# EAGLE design Pure Noise (EAGLE 9.6.2)
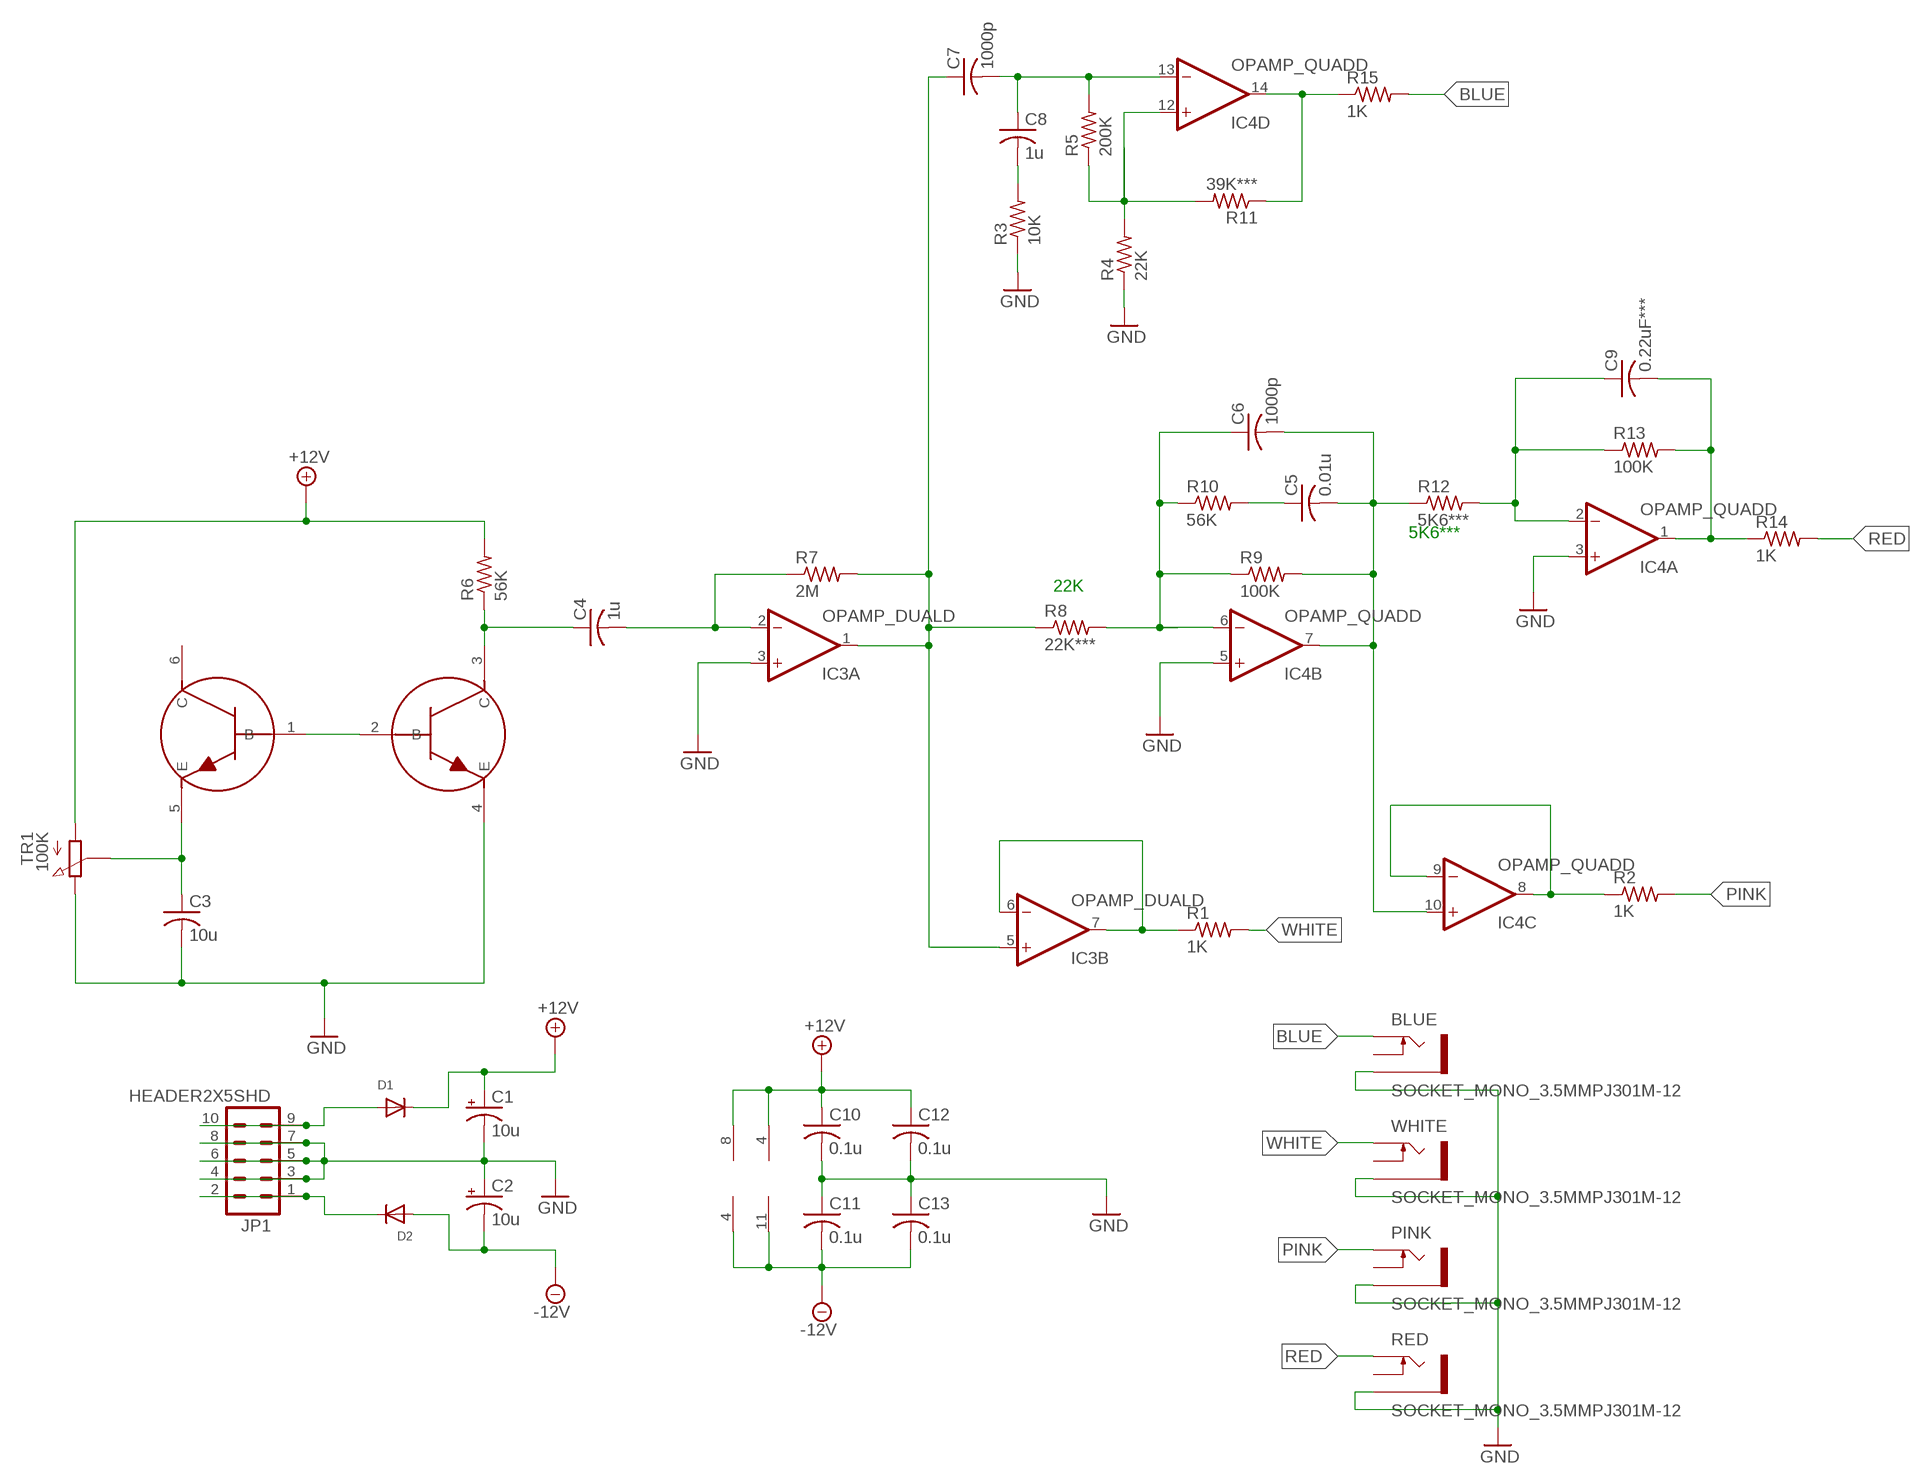
[diagram p0: schematic, sheet 1]

## Parts
BLUE  SOCKET_MONO_3.5MMPJ301M-12  [PJ301M-12]
C1  10u  CAPACITOR_POL-US153CLV-0505  [153CLV-0505]
C2  10u  CAPACITOR_POL-US153CLV-0505  [153CLV-0505]
C3  10u  CAPACITOR-USC0805  [C0805]
C4  1u  CAPACITOR-USC0805  [C0805]
C5  0.01u  CAPACITOR-USC0805  [C0805]
C6  1000p  CAPACITOR-USC0805  [C0805]
C7  1000p  CAPACITOR-USC0805  [C0805]
C8  1u  CAPACITOR-USC0805  [C0805]
C9  0.22uF***  CAPACITOR-USC0805  [C0805]
C10  0.1u  CAPACITOR-USC0805  [C0805]
C11  0.1u  CAPACITOR-USC0805  [C0805]
C12  0.1u  CAPACITOR-USC0805  [C0805]
C13  0.1u  CAPACITOR-USC0805  [C0805]
D1  DIODESMA  [SMADIODE]
D2  DIODESMA  [SMADIODE]
IC3  OPAMP_DUALD  [SO08]
IC4  OPAMP_QUADD  [SO14]
JP1  HEADER2X5SHD  [2X5-SHROUDED]
PINK  SOCKET_MONO_3.5MMPJ301M-12  [PJ301M-12]
R1  1K  RESISTOR_USR0805  [R0805]
R2  1K  RESISTOR_USR0805  [R0805]
R3  10K  RESISTOR_USR0805  [R0805]
R4  22K  RESISTOR_USR0805  [R0805]
R5  200K  RESISTOR_USR0805  [R0805]
R6  56K  RESISTOR_USR0805  [R0805]
R7  2M  RESISTOR_USR0805  [R0805]
R8  22K***  RESISTOR_USR0805  [R0805]
R9  100K  RESISTOR_USR0805  [R0805]
R10  56K  RESISTOR_USR0805  [R0805]
R11  39K***  RESISTOR_USR0805  [R0805]
R12  5K6***  RESISTOR_USR0805  [R0805]
R13  100K  RESISTOR_USR0805  [R0805]
R14  1K  RESISTOR_USR0805  [R0805]
R15  1K  RESISTOR_USR0805  [R0805]
RED  SOCKET_MONO_3.5MMPJ301M-12  [PJ301M-12]
T1  TRANSISTOR_PAIR_NPN  [TRANS_PAIR]
TR1  100K  RESISTOR_VARIABLETRIMMER_TH  [TRIMMER_TH]
WHITE  SOCKET_MONO_3.5MMPJ301M-12  [PJ301M-12]

## Nets
+12V: C1.+ C10.1 C12.1 D1.C IC3.8(P:V+) IC4.4(P:V+) R6.2 TR1.1
-12V: C2.- C11.2 C13.2 D2.A IC3.4(P:V-) IC4.11(P:V-)
BLUE: BLUE.TIP R15.2
GND: BLUE.GND(SLEEVE) C1.- C2.+ C3.2 C10.2 C11.1 C12.2 C13.1 IC3.3(A:+IN) IC4.3(A:+IN) IC4.5(B:+IN) JP1.3 JP1.4 JP1.5 JP1.6 JP1.7 JP1.8 PINK.GND(SLEEVE) R3.1 R4.1 RED.GND(SLEEVE) T1.4(E) TR1.3 WHITE.GND(SLEEVE)
N$1: IC3.6(B:-IN) IC3.7(B:OUT) R1.1
N$2: IC4.8(C:OUT) IC4.9(C:-IN) R2.1
N$3: C8.2 R3.2
N$4: C7.2 C8.1 IC4.13(D:-IN) R5.2
N$5: IC4.12(D:+IN) R4.2 R5.1 R11.2
N$6: C9.1 IC4.2(A:-IN) R12.2 R13.1
N$7: C9.2 IC4.1(A:OUT) R13.2 R14.1
N$9: D1.A JP1.9 JP1.10
N$10: D2.C JP1.1 JP1.2
N$11: IC4.14(D:OUT) R11.1 R15.1
N$12: T1.1(B) T1.2(B)
N$13: C3.1 T1.5(E) TR1.2
N$14: C4.1 R6.1 T1.3(C)
N$15: C4.2 IC3.2(A:-IN) R7.1
N$16: C6.1 IC4.6(B:-IN) R8.2 R9.1 R10.1
N$17: C5.1 R10.2
N$19: C7.1 IC3.1(A:OUT) IC3.5(B:+IN) R7.2 R8.1
N$23: C5.2 C6.2 IC4.7(B:OUT) IC4.10(C:+IN) R9.2 R12.1
PINK: PINK.TIP R2.2
RED: R14.2 RED.TIP
WHITE: R1.2 WHITE.TIP
Unconnected: BLUE.NORM(SWITCH) PINK.NORM(SWITCH) RED.NORM(SWITCH) T1.6(C) WHITE.NORM(SWITCH)

## Notes on the sheet
- 5K6***
- 22K

## Library data of the parts
BLUE PINK RED WHITE = GMSN:SOCKET_MONO_3.5MM: 3.5 mm Jack Socket; SORT: 8
C1 C2 = GMSN:CAPACITOR_POL-US: Electro Capacitor; SORT: 3
C3-C13 = GMSN:CAPACITOR-US: Capacitor; SORT: 3
D1 D2 = GMSN:DIODE: Diode SMADIODE - SMA Surface Mount Package 20V 1A Schottky Diode Digikey: 641-1014-6-ND DO-1N4148 - Through Hole Small Current Diode SOD-123 20V 1 A (.5mV Vf) Schottky Diode - Digikey: MBRX120TPMSCT-ND SOD-323 10V 570mA (.38mV Vf, 3ns) Schottky Diode - Digikey: ZLLS410CT-ND SOD-523 30V 30mA Schottky Diode (RB751S-40TE61) - Digikey: RB751S-40TE61CT-ND SOT23-R/W - SOT23 Package (R = Solder Paste/Reflow Ovens, W = Hand-Soldering) BAT54Film 40V 300mA - Digikey: 497-7162-1-ND; SORT: 3.9
IC3 = GMSN:OPAMP_DUAL: Dual Op Amp; SORT: 4.5
IC4 = GMSN:OPAMP_QUAD: OP AMP; SORT: 4.5
JP1 = GMSN:HEADER2X5: Header 5x2 Standard 10-pin dual row 0.1" header. Commonly used with AVR-ISP. Use with Spark Fun Electronics SKU: PRT-00778; SORT: 7
R1-R15 = GMSN:RESISTOR_US: Resistor; SORT: 2
T1 = GMSN:TRANSISTOR_PAIR_NPN: NPN Transistor Matched Pair; SORT: 4
TR1 = GMSN:RESISTOR_VARIABLE: Pot; SORT: 7

## Board
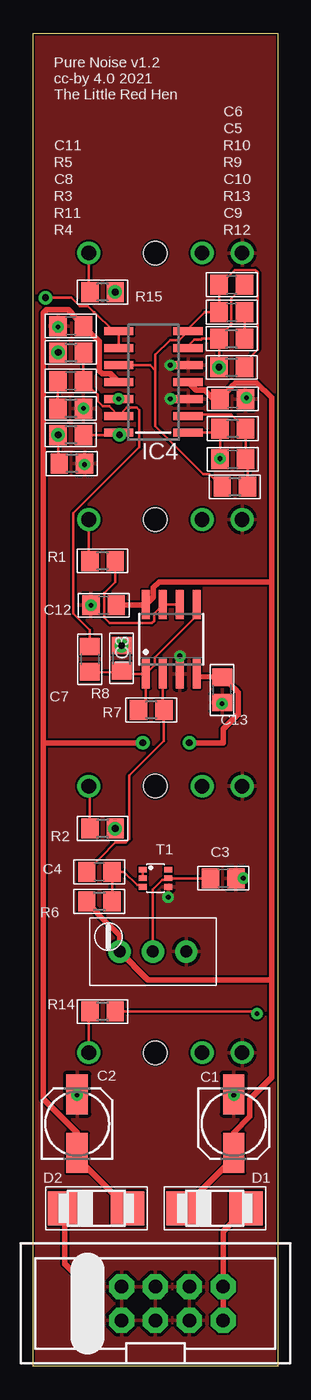
[diagram p1: board, top side]
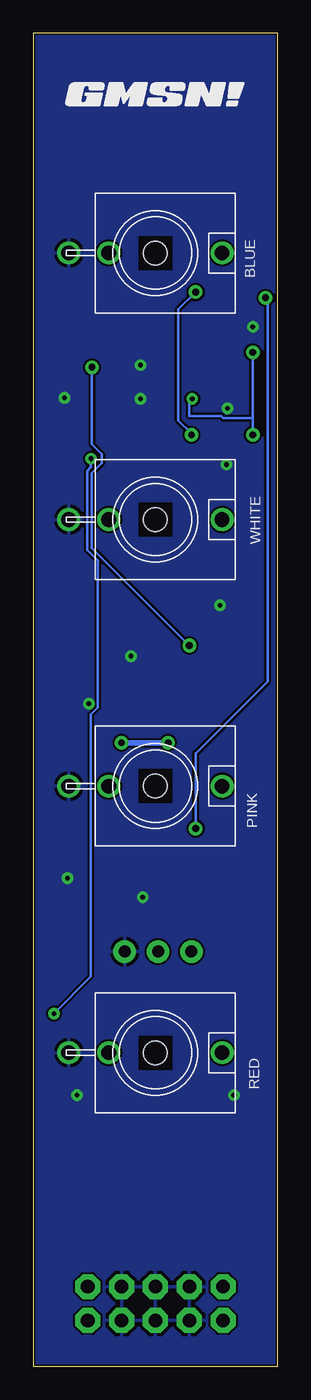
[diagram p2: board, bottom side, seen from below]

Size 18.32 x 100 mm. Coordinates in mm from the lower left corner, seen from the top.
Outline: 18.32,0 0,0 0,100 18.32,100 18.32,0
Copper layers (1*16): Top 0.035mm / dielectric 1.5mm / Bottom 0.035mm
Design rules "PCBWay": minimum track width 6mil, minimum drill 12mil, track to track 6mil, track to pad 6mil, pad to pad 6mil, via to via 6mil, smd to smd 6mil, copper to edge 6mil, drill to drill 6mil, minimum pad ring 12mil, minimum via ring 10mil, stop-mask expansion 4mil, vias tented up to drill 25mil, thermal gap 10mil

### Footprints (pad centres in the part's own frame; a part is rotated, then mirrored left to right if it is on the bottom)
PJ301M-12 = drill 1.1: GND 0,-6.5; NORM 0,-3.5; TIP 0,5 | hole 1.778: 0,0
153CLV-0505 = smd 3 x 1.6: + 2.2,0; - -2.2,0
C0805 = smd 1.3 x 1.5: 1 -0.95,0; 2 0.95,0
SMADIODE = smd 2.54 x 2.54: A 2.349,0; C -2.349,0
SO08 = smd 0.6 x 2.2: 1 -1.905,-2.6; 2 -0.635,-2.6; 3 0.635,-2.6; 4 1.905,-2.6; 5 1.905,2.6; 6 0.635,2.6; 7 -0.635,2.6; 8 -1.905,2.6
SO14 = smd 0.6 x 2.2: 1 -3.81,-2.6; 2 -2.54,-2.6; 3 -1.27,-2.6; 4 0,-2.6; 5 1.27,-2.6; 6 2.54,-2.6; 7 3.81,-2.6; 8 3.81,2.6; 9 2.54,2.6; 10 1.27,2.6; 11 0,2.6; 12 -1.27,2.6; 13 -2.54,2.6; 14 -3.81,2.6
2X5-SHROUDED = drill 1.016 pad 1.88 octagon: 1 -1.27,5.08; 2 1.27,5.08; 3 -1.27,2.54; 4 1.27,2.54; 5 -1.27,0; 6 1.27,0; 7 -1.27,-2.54; 8 1.27,-2.54; 9 -1.27,-5.08; 10 1.27,-5.08
R0805 = smd 1.3 x 1.5: 1 -0.95,0; 2 0.95,0
TRANS_PAIR = smd 0.42 x 0.6: 1 -0.65,-0.95; 2 0,-0.95; 3 0.65,-0.95; 4 0.65,0.95; 5 0,0.95; 6 -0.65,0.95
TRIMMER_TH = drill 0.9 pad 1.676: 1 -0.802,1.143; 2 -3.302,1.143; 3 -5.802,1.143

### Placement (x,y rotation side)
BLUE  9.16,83.52 270 bottom
C1  15.03,18.19 270 top
C2  3.29,18.19 90 top
C3  14.24,36.61 0 top
C4  4.95,37.09 180 top
C5  14.88,79.08 180 top
C6  14.88,81.14 180 top
C7  4.24,53.04 90 top
C8  2.81,73.92 180 top
C9  14.95,68.04 180 top
C10  14.95,72.57 0 top
C11  2.81,78.04 0 top
C12  5.27,57.09 180 top
C13  14.16,50.74 90 top
D1  13.61,11.84 0 top
D2  4.71,11.84 0 top
IC3  10.35,54.55 0 top
IC4  9,73.84 90 top
JP1  9.16,4.7 90 top
PINK  9.16,43.52 270 bottom
R1  5.19,60.42 180 top
R2  5.19,40.34 180 top
R3  2.81,71.85 180 top
R4  2.89,67.72 180 top
R5  2.81,76.06 0 top
R6  4.95,34.86 180 top
R7  8.84,49.23 180 top
R8  6.62,53.12 90 top
R9  14.88,74.95 0 top
R10  14.88,77.09 0 top
R11  2.81,69.87 180 top
R12  15.11,65.98 0 top
R13  14.95,70.34 180 top
R14  5.19,26.61 180 top
R15  5.19,80.58 180 top
RED  9.16,23.52 270 bottom
T1  9.16,36.61 270 top
TR1  5.67,32.24 180 top
U$3  [GMSN!_LOGO]  8.92,95.35 0 bottom
WHITE  9.16,63.52 270 bottom

### Tracks (layer width: path | path; a pad name or v marks a point on that pad's centre or on a via)
+12V
  Top 0.406: D1.C 15.03,15.62 C1.+ 15.03,17.52 16.24,18.73 16.24,20.04 17.86,21.66 17.86,28.91 | 17.86,58.83 17.86,28.91 | C12.1 8.39,57.09 IC3.8 9.01,57.71 9.01,58.42 9.43,58.83 17.86,58.83 | 17.86,28.91 17.78,28.99 8.58,28.99 TR1.1 6.47,32.32 4.85,33.94 4.85,34.02 R6.2 | 17.86,58.83 17.86,72.68 16.77,73.77 15.14,73.77 14.9,73.53 14.9,73.51 C10.1 13.5,72.57 12.85,73.22 12.22,73.22 IC4.4
-12V  (via drill 0.51)
  Top 0.406: D2.A 3.29,15.62 C2.- 3.29,17.52 0.75,20.05 0.75,46.77 | 0.75,46.77 0.75,79.01 0.99,79.25 2.63,79.25 2.87,79.01 2.87,78.99 C11.2 4.95,76.91 4.95,74.66 5.15,74.45 5.79,74.45 IC4.11 | 0.75,46.77 v8.21,46.77 | v11.7,46.77 14.24,46.77 14.24,47.79 15.37,48.92 15.37,50.56 15.13,50.8 15.1,50.8 C13.2 12.47,51.74 IC3.4
  Bottom 0.406: v8.21,46.77 v11.7,46.77
BLUE
  Top 0.203: BLUE.TIP 4.16,80.66 R15.2
GND  (via drill 0.35)
  other vias: 1.86,77.96 15.99,72.65 3.76,71.85 3.84,67.65 10.27,72.57 10.27,75.11 4.32,57.09 10.99,53.28 14.16,49.71 15.75,36.61 10.11,35.18 3.29,20.34 15.03,20.34
  pour Top: 18.32,100 0,100 0,0 18.32,0
  pour Bottom: 18.32,100 0,100 0,0 18.32,0
N$1
  Top 0.203: IC3.6 IC3.7 9.05,56.48 9.05,55.92 8.87,55.74 5.73,55.74 5.32,56.16 5.32,58.02 6.14,58.84 R1.1
N$2  (via drill 0.51)
  Top 0.2: 4.08,79.53 4.51,79.1 4.57,79.1 6.01,77.65 IC4.8 IC4.9
  Top 0.203: 4.08,79.53 3.46,79.53 2.83,80.16 v0.91,80.16
  Bottom 0.203: R2.1 6.14,45.98 0.75,51.37 0.75,80.01 v0.91,80.16
  other vias: 6.14,40.34
N$3
  Top 0.203: R3.2 1.81,71.9 C8.2
N$4
  Top 0.2: 4.82,72.91 4.82,72.39 5.2,72.01 5.68,72.01 IC4.13 7.01,71.91 7.28,71.91
  Top 0.203: R5.2 3.76,73.97 C8.1 4.82,72.91 | 7.28,71.91 7.78,71.91 7.95,71.73 7.95,68.95 3,64 3,56.48 4.24,55.24 C7.2
N$5  (via drill 0.35, 0.51)
  Top 0.203: R4.2 1.86,67.8 R11.2
  Bottom 0.2: 6.62,71.3 6.62,72.35 IC4.12
  Bottom 0.203: 1.86,71.14 R11.2 | 1.86,71.14 R5.1 | 6.62,71.3 4.25,71.3 4.07,71.12 3.46,71.12 3.44,71.14 1.86,71.14
  other vias: 1.86,69.87 1.86,76.06 6.4,72.57
N$6
  Top 0.2: 13.23,71.4 11.7,71.4 IC4.2
  Top 0.203: R12.2 16.06,67.93 C9.1 15.95,70.29 R13.1 14.85,71.4 13.23,71.4
N$7  (via drill 0.35)
  Top 0.2: IC4.1 13.69,70.03 R13.2 v14,68.09 C9.2 | R14.1 16.62,26.61 v16.78,26.45
  Bottom 0.2: v16.78,26.45 14,29.23 14,48.9 13.48,49.42 13.48,60.43 14.28,61.23 14.28,67.17 14,67.44 v14,68.09
N$9
  Top 0.406: JP1.9 JP1.10 14.24,10.13 D1.A
N$10
  Top 0.406: JP1.1 JP1.2 2.37,7.69 D2.C
N$11  (via drill 0.51)
  Top 0.2: IC4.14 6.46,69.97 v6.46,69.87
  Top 0.203: R11.1 v6.46,69.87
  Bottom 0.203: v6.46,69.87 6.46,69.99 7.43,70.96 7.43,79.29 R15.1
  other vias: 6.14,80.58
N$12
  Top 0.203: T1.2 T1.1
N$13
  Top 0.203: TR1.2 8.97,35.76 9.68,36.47 9.97,36.47 T1.5 C3.1
N$14
  Top 0.203: R6.1 5.9,37.04 C4.1 6.79,37.09 7.78,36.09 8.07,36.09 T1.3
N$15
  Top 0.2: 9.72,49.31 IC3.2
  Top 0.203: C4.2 6.15,39.29 6.92,39.29 7.2,39.57 7.2,44.33 9.79,46.92 R7.1 9.72,49.31
N$16  (via drill 0.51)
  Top 0.2: 12.08,77.04 11.6,76.56 IC4.6
  Top 0.203: C6.1 14.83,80.09 14.83,78.15 13.93,77.24 R10.1 | 12.08,77.04 12.58,77.04 12.63,77.09 R10.1 | R9.1 R10.1
  Bottom 0.203: R8.2 13.93,61.38 13.93,67.02 13.19,67.76 13.19,68.43 13.93,69.16 R9.1
  other vias: 13.93,74.95 6.62,54.07
N$17
  Top 0.203: R10.2 15.88,77.14 C5.1
N$19
  Top 0.2: R8.1 6.84,51.95 IC3.1 | IC3.1 9.11,52.61 | 8.45,49.78 IC3.1
  Top 0.203: R7.2 8.45,49.78 | R8.1 6.75,52.04 | 6.75,52.04 6.84,51.95 | 9.11,52.61 9.11,53.17 12.26,56.32 IC3.5 | C7.1 6.75,52.04
N$23
  Top 0.2: 10.76,76.99 10.94,76.99 IC4.7 11.6,77.83 12.85,79.08 | IC4.10 8.76,75.11
  Top 0.203: R12.1 13.2,66.94 12.74,66.94 9.16,70.52 9.16,74.71 | 8.76,75.11 9.16,74.71 | 10.76,76.99 10.27,76.99 9.16,75.88 9.16,74.71 | 12.85,79.08 C5.2 C6.2 13.99,81.14 15.1,82.24 16.65,82.24 16.83,82.07 16.83,76.27 15.82,75.26 R9.2
PINK
  Top 0.203: R2.2 4.24,43.44 PINK.TIP
RED
  Top 0.203: RED.TIP 4.16,26.53 R14.2
WHITE
  Top 0.203: R1.2 4.16,60.5 WHITE.TIP

### Text on the board
tPlace: Pure Noise v1.2 / cc-by 4.0 2021 / The Little Red Hen